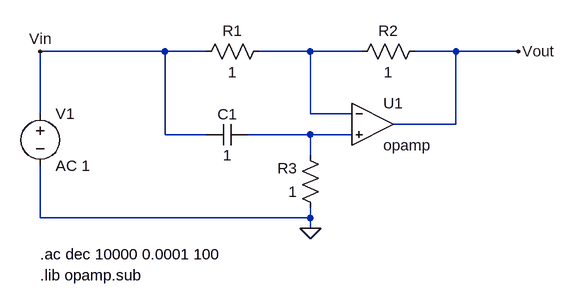
[diagram p0: schematic PasaTodoNormalizado.asc]
PasaTodoNormalizado.asc, the LTspice schematic file:
Version 4.1
SHEET 1 880 680
WIRE 48 -96 -144 -96
WIRE 112 -96 48 -96
WIRE 272 -96 192 -96
WIRE 352 -96 272 -96
WIRE 496 -96 432 -96
WIRE 592 -96 496 -96
WIRE -144 0 -144 -96
WIRE 272 0 272 -96
WIRE 336 0 272 0
WIRE 496 16 496 -96
WIRE 496 16 400 16
WIRE 48 32 48 -96
WIRE 112 32 48 32
WIRE 272 32 176 32
WIRE 336 32 272 32
WIRE 272 64 272 32
WIRE -144 160 -144 80
WIRE 272 160 272 144
WIRE 272 160 -144 160
WIRE 272 176 272 160
FLAG 272 176 0
FLAG -144 -96 Vin
FLAG 592 -96 Vout
SYMBOL res 208 -112 R90
WINDOW 0 0 56 VBottom 2
WINDOW 3 32 56 VTop 2
SYMATTR InstName R1
SYMATTR Value 1
SYMBOL res 448 -112 R90
WINDOW 0 0 56 VBottom 2
WINDOW 3 32 56 VTop 2
SYMATTR InstName R2
SYMATTR Value 1
SYMBOL res 288 160 R180
WINDOW 0 36 76 Left 2
WINDOW 3 36 40 Left 2
SYMATTR InstName R3
SYMATTR Value 1
SYMBOL cap 176 16 R90
WINDOW 0 0 32 VBottom 2
WINDOW 3 32 32 VTop 2
SYMATTR InstName C1
SYMATTR Value 1
SYMBOL voltage -144 -16 R0
SYMATTR InstName V1
SYMATTR Value AC 1
SYMBOL OpAmps\\opamp 368 -48 R0
SYMATTR InstName U1
TEXT -144 216 Left 2 !.ac dec 10000 0.0001 100
TEXT -144 248 Left 2 !.lib opamp.sub

The netlist it stands for:
* PasaTodoNormalizado.asc
R1 N001 Vin 1
R2 Vout N001 1
R3 0 N002 1
C1 N002 Vin 1
V1 Vin 0 AC 1
X§U1 N001 N002 Vout opamp Aol=100K GBW=10Meg  ; pins invin noninvin out
.ac dec 10000 0.0001 100
.lib opamp.sub
.backanno
.end